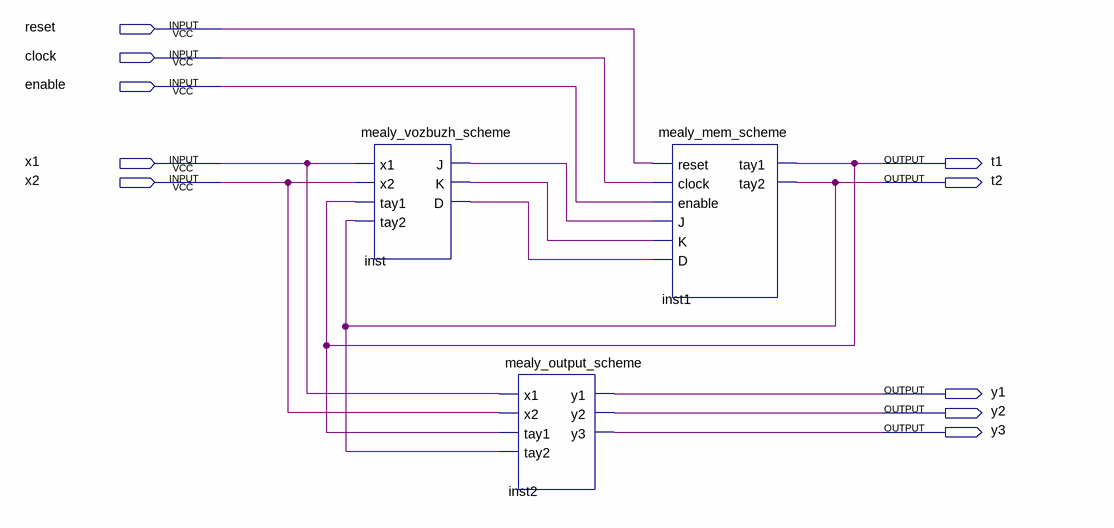
[diagram p0: schematic sheet]
// Quartus schematic mealy_decompose_scheme.bdf as structural Verilog: 3 symbols, 10 pins
module mealy_decompose_scheme (
  input  reset,
  input  clock,
  input  enable,
  input  x1,
  input  x2,
  output t1,
  output t2,
  output y1,
  output y2,
  output y3
);

  wire inst_d, inst_j, inst_k;

  mealy_vozbuzh_scheme inst (.x1(x1), .x2(x2), .tay1(t1), .tay2(t2), .J(inst_j), .K(inst_k), .D(inst_d));
  mealy_output_scheme inst2 (.x1(x1), .x2(x2), .tay1(t1), .tay2(t2), .y1(y1), .y2(y2), .y3(y3));
  mealy_mem_scheme inst1 (
    .reset(reset), .clock(clock), .enable(enable), .J(inst_j), .K(inst_k), .D(inst_d), .tay1(t1), .tay2(t2));
endmodule
